# Altium schematic sheet 2016-12-04_20-58-031.schdoc
size 298 x 111 mm; SheetNumber: 1; SheetTotal: 1
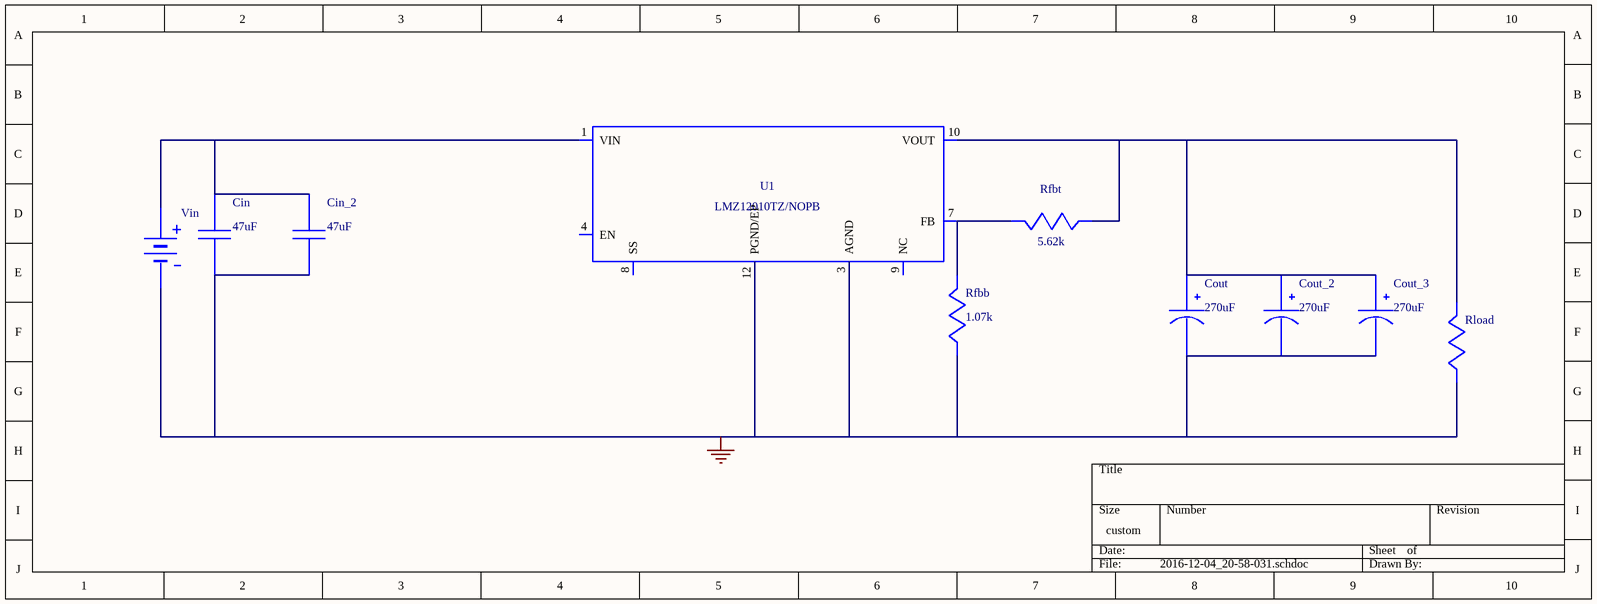
[diagram p0: 2016-12-04_20-58-031.schdoc]

## Parts
Cin  value 47uF  (hidden comment: C3216X5R1E476M160AC)
Cin_2  value 47uF  (hidden comment: C3216X5R1E476M160AC)
Cout  value 270uF  (hidden comment: 16SVPG270M)
Cout_2  value 270uF  (hidden comment: 16SVPG270M)
Cout_3  value 270uF  (hidden comment: 16SVPG270M)
Rfbb  value 1.07k  (hidden comment: ERJ-6ENF1071V)
Rfbt  value 5.62k  (hidden comment: ERJ-6ENF5621V)
Rload  WB_LOAD_RESISTOR  (value not drawn)
U1  LMZ12010TZ/NOPB
Vin  WB_BATTERY  (value not drawn)

## Nets
0: Cin.2 Cin_2.2 Cout.2(-) Cout_2.2(-) Cout_3.2(-) Rfbb.2 Rload.2 U1.3(AGND) U1.5(AGND) U1.6(AGND) U1.12(PGND/EP) Vin.2(-)
NetCin_1: Cin.1 Cin_2.1 U1.1(VIN) U1.2(VIN) Vin.1(+)
NetCout_1: Cout.1(+) Cout_2.1(+) Cout_3.1(+) Rfbt.2 Rload.1 U1.10(VOUT) U1.11(VOUT)
NetRfbb_1: Rfbb.1 Rfbt.1 U1.7(FB)

Not connected (* = marked no-connect by the designer): U1 4(EN) 8(SS) 9(NC)

## Library data of the parts
Cin Cin_2 = C3216X5R1E476M160AC: C3216X5R1E476M16; Manufacturer Name: TDK; PackageReference: C3216X5R1E476M160AC; Manufacturer Part Number: C3216X5R1E476M160AC
Cout Cout_2 Cout_3 = 16SVPG270M: Manufacturer Name: Panasonic; PackageReference: 16SVPG270M; Manufacturer Part Number: 16SVPG270M
Rfbb = ERJ-6ENF1071V: Manufacturer Name: Panasonic; PackageReference: ERJ-6ENF1071V; Manufacturer Part Number: ERJ-6ENF1071V
Rfbt = ERJ-6ENF5621V: Manufacturer Name: Panasonic; PackageReference: ERJ-6ENF5621V; Manufacturer Part Number: ERJ-6ENF5621V
U1 = LMZ12010TZ/NOPB: Manufacturer Name: Texas Instruments; PackageReference: LMZ12010TZ/NOPB; Manufacturer Part Number: LMZ12010TZ/NOPB; Value: N/A
Rload = WB_LOAD_RESISTOR: PackageReference: WB_LOAD_RESISTOR; Manufacturer Part Number: WB_LOAD_RESISTOR; Manufacturer Name: WB_LOAD_RESISTOR; Value: N/A
Vin = WB_BATTERY: PackageReference: WB_BATTERY; Manufacturer Part Number: WB_BATTERY; Manufacturer Name: WB_BATTERY; Value: N/A